# Altium schematic sheet Top.SchDoc
size Letter
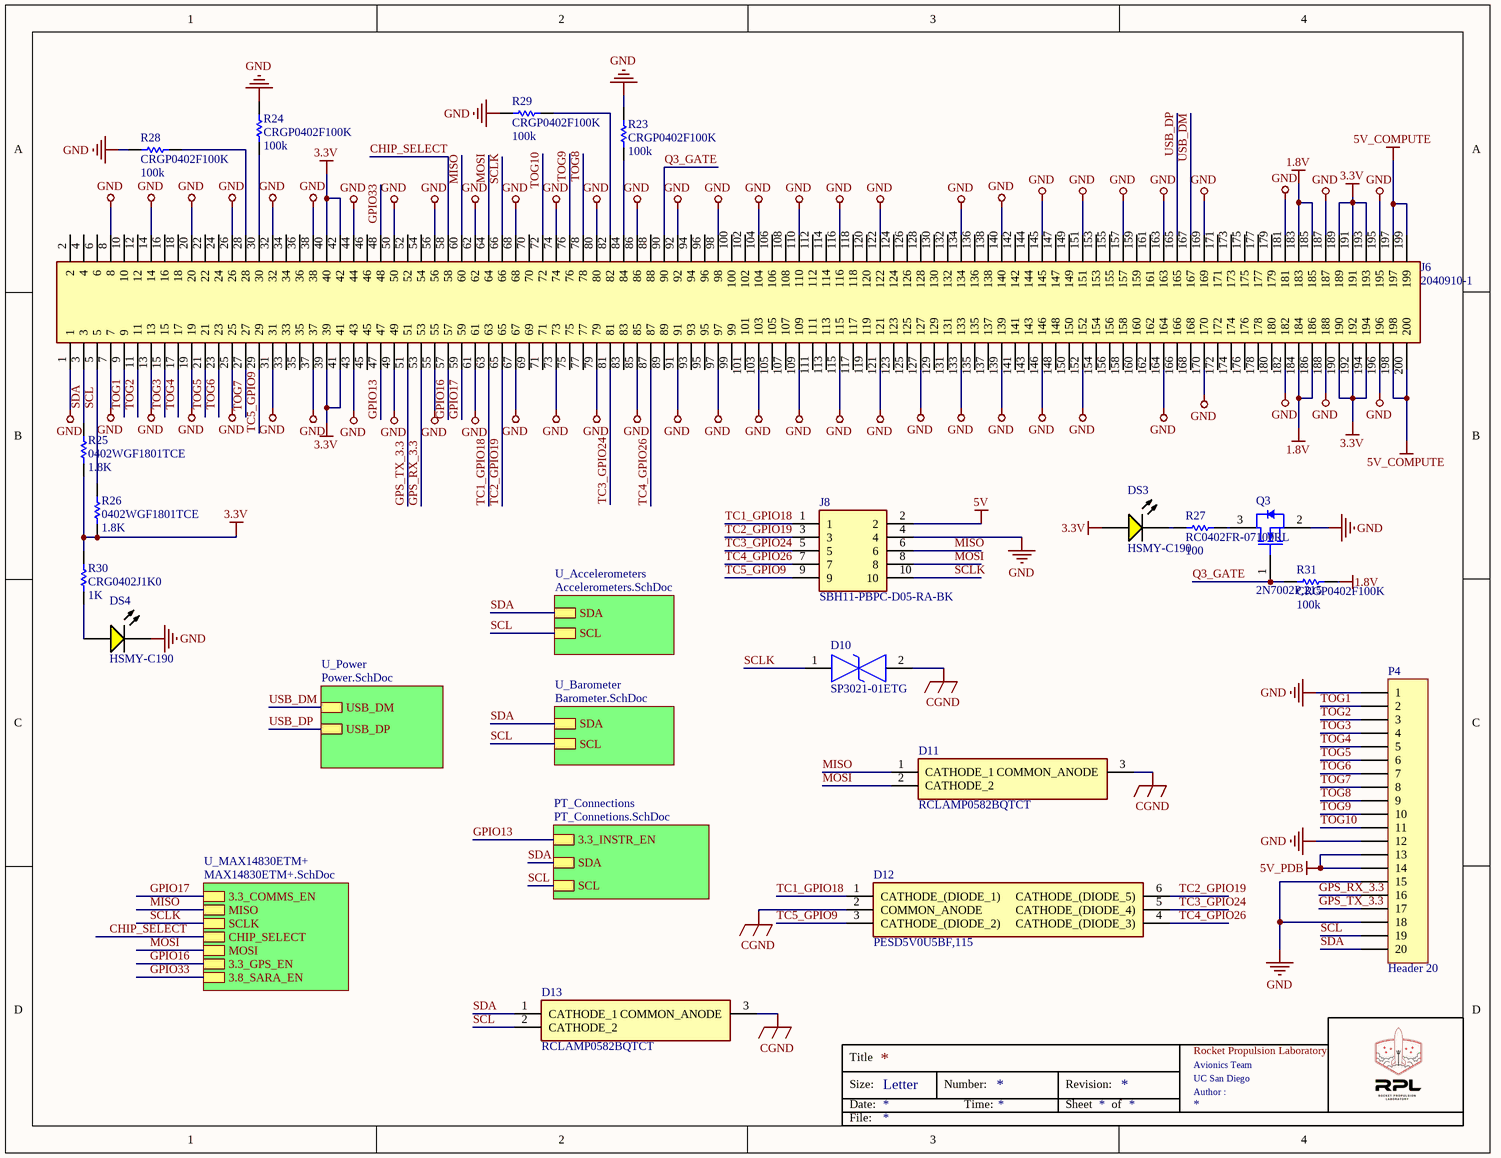
[diagram p0: Top.SchDoc]

## Parts
D10  SP3021-01ETG  [SP302101ETG]
D11  RCLAMP0582BQTCT  [SOT50P160X90-3N]
D12  PESD5V0U5BF,115  [PESD5V0U5BF115]
D13  RCLAMP0582BQTCT  [SOT50P160X90-3N]
DS3  HSMY-C190  [AVAG-HSMX-C190_V]
DS4  HSMY-C190  [AVAG-HSMX-C190_V]
J6  2040910-1  [20409101]
J8  SBH11-PBPC-D05-RA-BK  [SHDRRA10W64P254_2X5_1270X910X880P]
P4  Header 20  [HDR1X20]
Q3  2N7002P,215  [NXP-SOT23_L]
R23  CRGP0402F100K  value 100k  [0402]
R24  CRGP0402F100K  value 100k  [0402]
R25  0402WGF1801TCE  value 1.8K  [0402]
R26  0402WGF1801TCE  value 1.8K  [0402]
R27  RC0402FR-07100RL  spec: 100  [RESC1005X40X25ML05T10]
R28  CRGP0402F100K  value 100k  [0402]
R29  CRGP0402F100K  value 100k  [0402]
R30  CRG0402J1K0  value 1K  [0402]
R31  CRGP0402F100K  value 100k  [0402]

## Sub-sheets
PT_Connections = PT_Connetions.SchDoc: 3.3_INSTR_EN, SDA, SCL
U_Accelerometers = Accelerometers.SchDoc: SDA, SCL
U_Barometer = Barometer.SchDoc: SDA, SCL
U_MAX14830ETM+ = MAX14830ETM+.SchDoc: 3.3_COMMS_EN, MISO, SCLK, CHIP_SELECT, MOSI, 3.3_GPS_EN, 3.8_SARA_EN
U_Power = Power.SchDoc: USB_DM, USB_DP

## Nets
1.8V: J6.183 J6.184 J6.185 J6.186 R31.2
3.3V: DS3.1(A) J6.39 J6.40 J6.41 J6.42 J6.189 J6.190 J6.191 J6.192 J6.193 J6.194 R25.1 R26.1 R30.1
5V: J8.2
5V_COMPUTE: J6.197 J6.198 J6.199 J6.200
5V_PDB: P4.13 P4.14
CGND: D10.2 D11.3(COMMON_ANODE) D12.2(COMMON_ANODE) D13.3(COMMON_ANODE)
GND: DS4.2(K) J6.1 J6.7 J6.8 J6.13 J6.14 J6.19 J6.20 J6.25 J6.26 J6.31 J6.32 J6.37 J6.38 J6.43 J6.44 J6.49 J6.50 J6.55 J6.56 J6.61 J6.62 J6.67 J6.68 J6.73 J6.74 J6.79 J6.80 J6.85 J6.86 J6.91 J6.92 J6.97 J6.98 J6.103 J6.104 J6.109 J6.110 J6.115 J6.116 J6.121 J6.122 J6.127 J6.133 J6.134 J6.139 J6.140 J6.145 J6.146 J6.151 J6.152 J6.157 J6.163 J6.164 J6.169 J6.170 J6.181 J6.182 J6.187 J6.188 J6.195 J6.196 J8.4 P4.1 P4.12 P4.15 P4.18 Q3.2(S) R23.2 R24.2 R28.2 R29.2
CHIP_SELECT: J6.58 ; sheet U_MAX14830ETM+/CHIP_SELECT
GPIO13: J6.47 ; sheet PT_Connections/3.3_INSTR_EN
GPIO16: J6.57 ; sheet U_MAX14830ETM+/3.3_GPS_EN
GPIO17: J6.59 ; sheet U_MAX14830ETM+/3.3_COMMS_EN
GPIO33: J6.48 ; sheet U_MAX14830ETM+/3.8_SARA_EN
GPS_RX_3.3: J6.53 P4.16
GPS_TX_3.3: J6.51 P4.17
MISO: D11.1(CATHODE_1) J6.60 J8.6 ; sheet U_MAX14830ETM+/MISO
MOSI: D11.2(CATHODE_2) J6.64 J8.8 ; sheet U_MAX14830ETM+/MOSI
Q3_GATE: J6.90 Q3.1(G) R31.1
SCL: D13.2(CATHODE_2) J6.5 P4.19 R26.2 ; sheet U_Accelerometers/SCL, sheet U_Barometer/SCL, sheet PT_Connections/SCL
SCLK: D10.1 J6.66 J8.10 ; sheet U_MAX14830ETM+/SCLK
SDA: D13.1(CATHODE_1) J6.3 P4.20 R25.2 ; sheet U_Accelerometers/SDA, sheet U_Barometer/SDA, sheet PT_Connections/SDA
TC1_GPIO18: D12.1(CATHODE_(DIODE_1)) J6.63 J8.1
TC2_GPIO19: D12.6(CATHODE_(DIODE_5)) J6.65 J8.3
TC3_GPIO24: D12.5(CATHODE_(DIODE_4)) J6.81 J8.5
TC4_GPIO26: D12.4(CATHODE_(DIODE_3)) J6.87 J8.7
TC5_GPIO9: D12.3(CATHODE_(DIODE_2)) J6.29 J8.9
TOG1: J6.9 P4.2
TOG2: J6.11 P4.3
TOG3: J6.15 P4.4
TOG4: J6.17 P4.5
TOG5: J6.21 P4.6
TOG6: J6.23 P4.7
TOG7: J6.27 P4.8
TOG8: J6.78 P4.9
TOG9: J6.76 P4.10
TOG10: J6.72 P4.11
USB_DM: J6.167 ; sheet U_Power/USB_DM
USB_DP: J6.165 ; sheet U_Power/USB_DP
NetDS3_2: DS3.2(K) R27.2
NetDS4_1: DS4.1(A) R30.2
NetJ6_28: J6.28 R28.1
NetJ6_30: J6.30 R24.1
NetJ6_82: J6.82 R29.1
NetJ6_84: J6.84 R23.1
NetQ3_3: Q3.3(D) R27.1

Not connected (* = marked no-connect by the designer): J6 2 4 6 10 12 16 18 22 24 33 34 35 36 45 46 52 54 69 70 71 75 77 83 88 89 93 94 95 96 99 100 101 102 105 106 107 108 111 112 113 114 117 118 119 120 123 124 125 126 128 129 130 131 132 135 136 137 138 141 142 143 144 147 148 149 150 153 154 155 156 158 159 160 161 162 166 168 171 172 173 174 175 176 177 178 179 180

## Notes on the sheet
- Title
- Size:
- Date:
- Letter
- Number:
- Time:
- Revision:
- Sheet
- of
- Rocket Propulsion Laboratory
- UC San Diego
- Avionics Team
- Author :
- File:

## Library data of the parts
D10 = SP3021-01ETG: TVS Diode (Bi-directional); Manufacturer_Name: LITTELFUSE; Datasheet Link: http://www.farnell.com/datasheets/2301234.pdf; Height: 0.6mm; Manufacturer_Part_Number: SP3021-01ETG; Arrow Part Number: SP3021-01ETG; Arrow Price/Stock: https://www.arrow.com/en/products/sp3021-01etg/littelfuse; Mouser Part Number: 576-SP3021-01ETG; Mouser Price/Stock: https://www.mouser.co.uk/ProductDetail/Littelfuse/SP3021-01ETG?qs=Dj8dEyEphkMM8WgFF2cfqw%3D%3D
D11 D13 = RCLAMP0582BQTCT: TVS Diode (Uni-directional); Manufacturer_Name: SEMTECH; Datasheet Link: https://www.semtech.com/uploads/documents/rclamp0582bq.pdf; Height: 0.9mm; Manufacturer_Part_Number: RCLAMP0582BQTCT; Arrow Part Number: RCLAMP0582BQTCT; Arrow Price/Stock: https://www.arrow.com/en/products/rclamp0582bqtct/semtech; Mouser Part Number: 947-RCLAMP0582BQTCT; Mouser Price/Stock: https://www.mouser.co.uk/ProductDetail/Semtech/RCLAMP0582BQTCT?qs=rBWM4%252BvDhIdyuNQteOG89g%3D%3D
D12 = PESD5V0U5BF,115: TVS Diode (Uni-directional); Manufacturer_Name: Nexperia; Datasheet Link: https://assets.nexperia.com/documents/data-sheet/PESD5V0U5BF_PESD5V0U5BV.pdf; Height: 0.5mm; Manufacturer_Part_Number: PESD5V0U5BF,115; Arrow Part Number: PESD5V0U5BF,115; Arrow Price/Stock: https://www.arrow.com/en/products/pesd5v0u5bf115/nexperia; Mouser Part Number: 771-PESD5V0U5BF,115; Mouser Price/Stock: https://www.mouser.co.uk/ProductDetail/Nexperia/PESD5V0U5BF115?qs=PJ263BbL1t3SJO%2F8qTg1Uw%3D%3D
DS3 DS4 = CMP-1744-00003-1: LED Uni-Color Yellow, 65 mW, 20 mA, -40 to 85 degC, 2-Pin SMD, RoHS, Tape and Reel; Tolerance: 1%; Voltage Rating: 50 V; Power Rating: 100 mW; Case\Package: 0603; Resistance: 390 Ohm; Min Operating Temperature: -55 degC; Length: 1.6 mm; ComponentLink3Description: Package Specification; Mount: Surface Mount; PackageReference: HSMX-C190; ComponentLink2Description: Datasheet; DatasheetVersion: Mar-12; Case Code (Metric): 1608; Pins: 2; Package Quantity: 5000; ComponentLink2URL: http://docs.avagotech.com/docs/AV02-0551EN; ComponentLink1Description: Manufacturer URL; RoHSCompliant: true; Packaging: Tape and Reel; PackageDescription: 2-Pin Surface Mount Device, Body 1.6 x 0.8 mm, Height 0.9 mm; REACH SVHC: No SVHC; ComponentLink3URL: http://www.fairchildsemi.com/dwg/MA/MA03D.pdf; Voltage Rating (DC): 50 V; Width: 0.8 mm; ComponentLink1URL: http://www.avagotech.com/; Max Operating Temperature: 155 degC; Case Code (Imperial): 0603; Height: 0.45 mm
J6 = 2040910-1: Connector; Manufacturer_Name: TE Connectivity; Datasheet Link: https://www.arrow.com/en/products/2040910-1/te-connectivity; Height: 15mm; Manufacturer_Part_Number: 2040910-1; Arrow Part Number: 2040910-1; Arrow Price/Stock: https://www.arrow.com/en/products/2040910-1/te-connectivity; Mouser Part Number: 571-2040910-1; Mouser Price/Stock: https://www.mouser.co.uk/ProductDetail/TE-Connectivity/2040910-1?qs=kAqyOuzYGe9tF8FZbDgYRA%3D%3D
J8 = SBH11-PBPC-D05-RA-BK: Connector; Manufacturer_Name: Sullins; Datasheet Link: http://sullinscorp.com/catalogs/145_PAGE118_.100_SBH11_SERIES_MALE_BOX_HDR_ST_RA_SMT.pdf; Height: 8.8mm; Manufacturer_Part_Number: SBH11-PBPC-D05-RA-BK; Arrow Part Number: SBH11-PBPC-D05-RA-BK
P4 = Header 20: Header, 20-Pin; LatestRevisionDate: 17-Jul-2002; LatestRevisionNote: Re-released for DXP Platform.; Publisher: Altium Limited
Q3 = CMP-1259-00082-1: N-Channel Trench MOSFET, 60 V, 0.36 A, -55 to 150 degC, 3-Pin SOT23, Tape and Reel; Manufacturer: NXP Semiconductors; Channel Type: N; Automotive Qualified: Y; VDS [max] (V): 60; Packing: Tape & Reel; ID [max] (A): 0.36; VGSth [typ] (V): 1.75; IDM [max] (A): 1.2; ComponentLink2URL: http://www.nxp.com/documents/data_sheet/2N7002P.pdf; PackageReference: SOT23; PackageVersion: 06-03-16, 03/2006; ComponentLink1URL: http://www.nxp.com/; ComponentLink2Description: Datasheet; Mounting Technology: Surface Mount; PackageDescription: 3-Pin Small Outline Transistor Package, Body 2.9 x 1.3 mm, Pitch 0.95 mm; Code_JEDEC: TO-236AB; ComponentLink1Description: Manufacturer URL; PartNumber: 2N7002P,215; ComponentLink3Description: Package Specification; DatasheetVersion: Rev. 02; ComponentLink3URL: http://www.nxp.com/documents/outline_drawing/sot023_po.pdf
R23-R26 R28-R31 = Res1: Resistor; Published: 8-Jun-2000; LatestRevisionDate: 17-Jul-2002; LatestRevisionNote: Re-released for DXP Platform.; PackageReference: AXIAL-0.3; Publisher: Altium Limited; PackageDescription: Axial Device, Thru-Hole; 2 Leads; 0.3 in Pin Spacing
R27 = CMP-2002-07344-1: Manufacturer: Yageo / Phycomp; Part Number: RC0402FR-07100RL